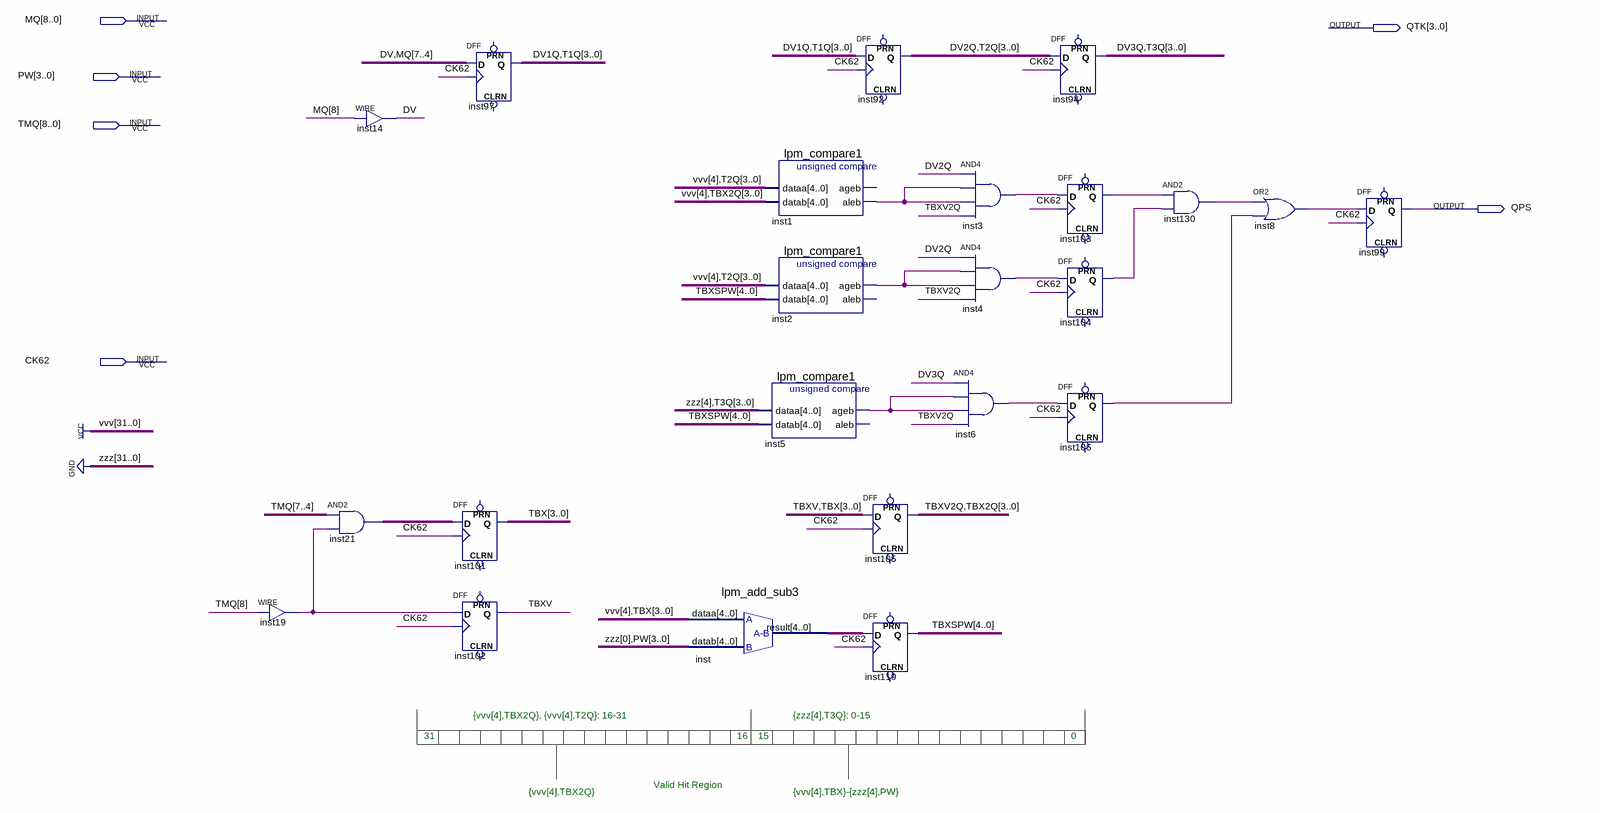
[diagram p0: schematic sheet]
// Quartus schematic ChTK16nsB.bdf as structural Verilog: 23 symbols, 6 pins
module ChTK16nsB (
  input  [8:0] MQ,
  input  [3:0] PW,
  input  [8:0] TMQ,
  input  CK62,
  output [3:0] QTK,
  output QPS
);

  wire DV, DV1Q, DV2Q, DV3Q, inst1_aleb, inst2_ageb, inst3_out, inst4_out, inst5_ageb, inst6_out, inst8_out,
       inst19_out, inst103_q, inst104_q, inst106_q, inst130_out, TBXV, TBXV2Q;
  wire [3:0] inst21_out, T1Q, T2Q, T3Q, TBX, TBX2Q;
  wire [4:0] inst_result, TBXSPW;

  assign inst19_out = TMQ[8];  // WIRE inst19
  assign DV = MQ[8];  // WIRE inst14
  assign inst21_out = TMQ[7:4] & {4{inst19_out}};  // AND2 inst21, 4 bits wide
  DFF inst97[4:0] (.CLK(CK62), .D({DV, MQ[7:4]}), .Q({DV1Q, T1Q}));  // open: CLRN, PRN
  DFF inst101[3:0] (.CLK(CK62), .D(inst21_out), .Q(TBX));  // open: CLRN, PRN
  DFF inst102 (.CLK(CK62), .D(inst19_out), .Q(TBXV));  // open: CLRN, PRN
  lpm_add_sub3 inst (.dataa({1'b1, TBX}), .datab({1'b0, PW}), .result(inst_result));
  lpm_compare1 inst1 (.dataa({1'b1, T2Q}), .datab({1'b1, TBX2Q}), .aleb(inst1_aleb));  // open: ageb
  lpm_compare1 inst2 (.dataa({1'b1, T2Q}), .datab(TBXSPW), .ageb(inst2_ageb));  // open: aleb
  lpm_compare1 inst5 (.dataa({1'b0, T3Q}), .datab(TBXSPW), .ageb(inst5_ageb));  // open: aleb
  DFF inst92[4:0] (.CLK(CK62), .D({DV1Q, T1Q}), .Q({DV2Q, T2Q}));  // open: CLRN, PRN
  DFF inst105[4:0] (.CLK(CK62), .D({TBXV, TBX}), .Q({TBXV2Q, TBX2Q}));  // open: CLRN, PRN
  DFF inst119[4:0] (.CLK(CK62), .D(inst_result), .Q(TBXSPW));  // open: CLRN, PRN
  and inst3 (inst3_out, DV2Q, inst1_aleb, inst1_aleb, TBXV2Q);
  and inst4 (inst4_out, DV2Q, inst2_ageb, inst2_ageb, TBXV2Q);
  and inst6 (inst6_out, DV3Q, inst5_ageb, inst5_ageb, TBXV2Q);
  DFF inst94[4:0] (.CLK(CK62), .D({DV2Q, T2Q}), .Q({DV3Q, T3Q}));  // open: CLRN, PRN
  DFF inst103 (.CLK(CK62), .D(inst3_out), .Q(inst103_q));  // open: CLRN, PRN
  DFF inst104 (.CLK(CK62), .D(inst4_out), .Q(inst104_q));  // open: CLRN, PRN
  DFF inst106 (.CLK(CK62), .D(inst6_out), .Q(inst106_q));  // open: CLRN, PRN
  and inst130 (inst130_out, inst103_q, inst104_q);
  or inst8 (inst8_out, inst130_out, inst106_q);
  DFF inst99 (.CLK(CK62), .D(inst8_out), .Q(QPS));  // open: CLRN, PRN

  // Notes on the sheet:
  //   {vvv[4],TBX2Q}, {vvv[4],T2Q}: 16-31
  //   {zzz[4],T3Q}: 0-15
  //   31
  //   16
  //   15
  //   0
  //   Valid Hit Region
  //   {vvv[4],TBX2Q}
  //   {vvv[4],TBX}-{zzz[4],PW}
endmodule
